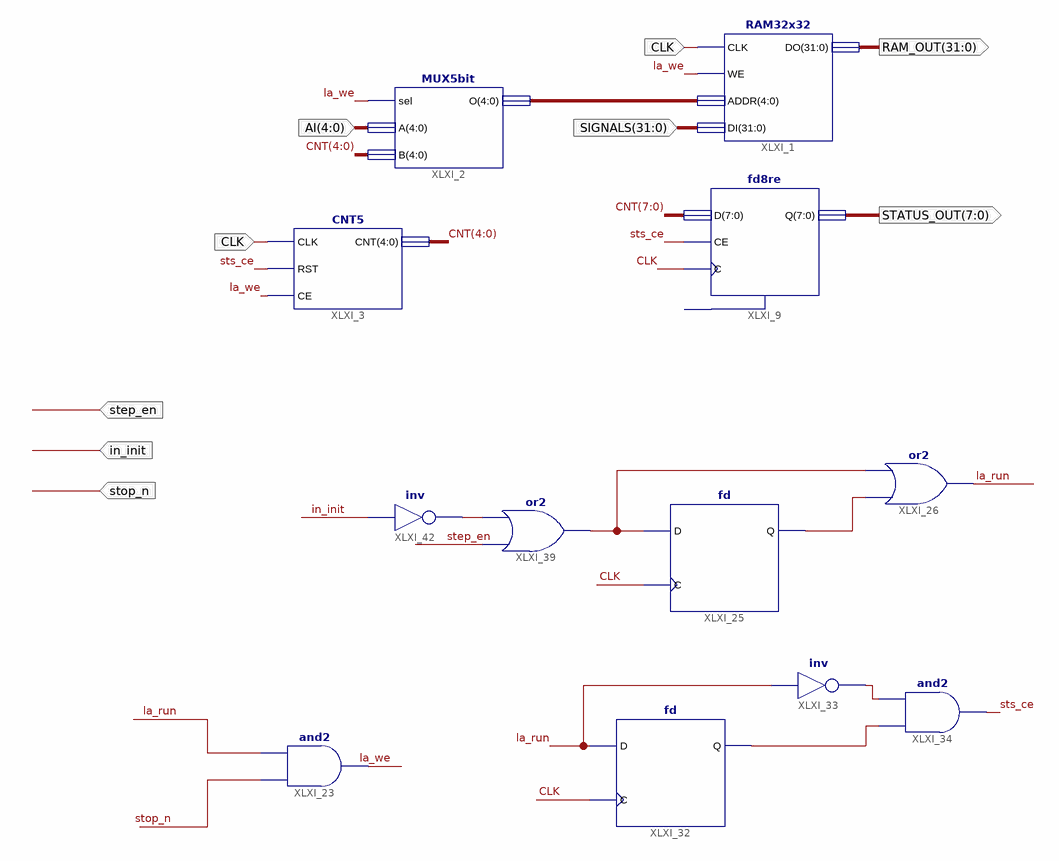
[diagram p0: schematic sheet 1]
// Xilinx ISE schematic LogiAnalyzer.sch (spartan6) as structural Verilog: 12 symbols, 8 ports
module LogiAnalyzer (
  input  CLK,
  input  [31:0] SIGNALS,
  input  [4:0] AI,
  input  step_en,
  input  in_init,
  input  stop_n,
  output [7:0] STATUS_OUT,
  output [31:0] RAM_OUT
);

  wire la_run, la_we, sts_ce, XLXN_73, XLXN_89, XLXN_124, XLXN_176, XLXN_177;
  wire [4:0] XLXN_8;
  wire [7:0] CNT;

  CNT5 XLXI_3 (.CLK(CLK), .RST(sts_ce), .CE(la_we), .CNT(CNT[4:0]));
  fd8re XLXI_9 (.C(CLK), .CE(sts_ce), .D(CNT), .Q(STATUS_OUT));  // open: R
  RAM32x32 XLXI_1 (.CLK(CLK), .WE(la_we), .ADDR(XLXN_8), .DI(SIGNALS), .DO(RAM_OUT));
  MUX5bit XLXI_2 (.sel(la_we), .A(AI), .B(CNT[4:0]), .O(XLXN_8));
  or XLXI_26 (la_run, XLXN_73, XLXN_177);
  fd XLXI_25 (.C(CLK), .D(XLXN_177), .Q(XLXN_73));
  fd XLXI_32 (.C(CLK), .D(la_run), .Q(XLXN_89));
  and XLXI_34 (sts_ce, XLXN_89, XLXN_124);
  not XLXI_33 (XLXN_124, la_run);
  and XLXI_23 (la_we, stop_n, la_run);
  or XLXI_39 (XLXN_177, step_en, XLXN_176);
  not XLXI_42 (XLXN_176, in_init);
endmodule
